# Altium schematic sheet Схемотехника-2.SchDoc
size 500 x 500 mm
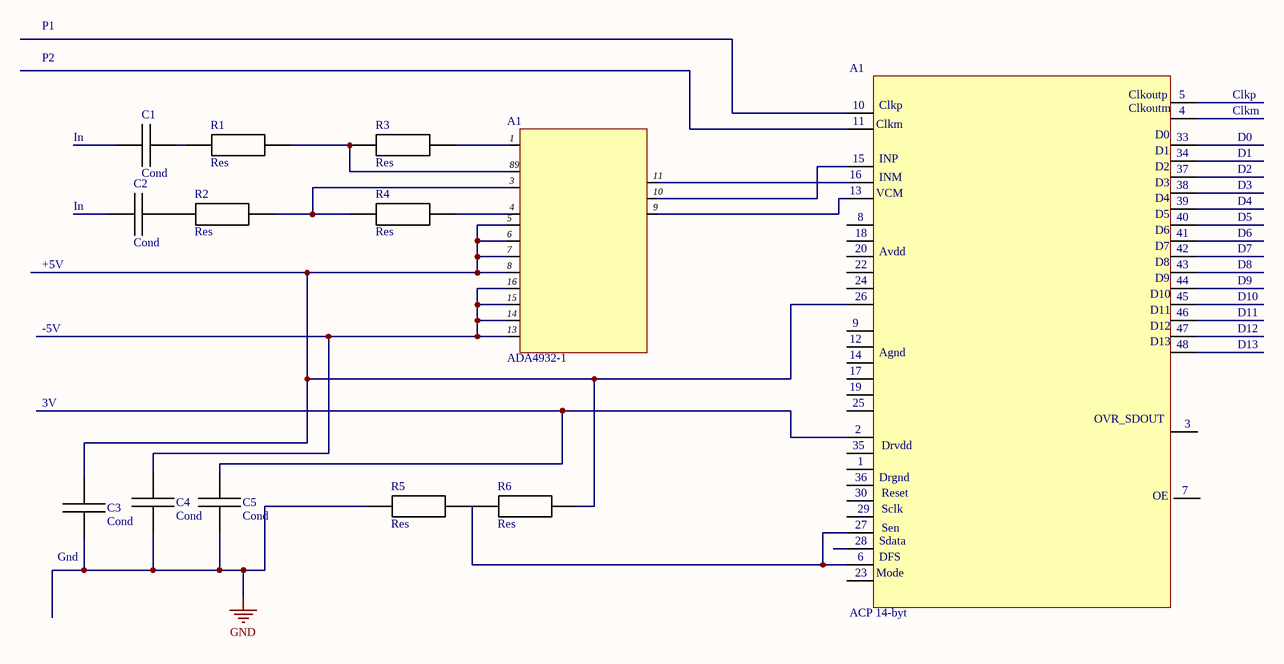
[diagram p0: Схемотехника-2.SchDoc]

## Parts
(Parts that share a designator on the sheet are numbered #1, #2 ... from top to bottom, then left to right.)
A1#1  ADA4932-1  [ADA4932-2]
A1#2  ACP 14-byt  [ads61b49]
C1  Cond  [Capacitor]
C2  Cond  [Capacitor]
C3  Cond  [Capacitor]
C4  Cond  [Capacitor]
C5  Cond  [Capacitor]
R1  Res  [Resistor]
R2  Res  [Resistor]
R3  Res  [Resistor]
R4  Res  [Resistor]
R5  Res  [Resistor]
R6  Res  [Resistor]

## Nets
GND: C3.2 C4.2 C5.2 R5.1
NetA1#1_1: A1#1.1 R3.2
NetA1#1_3: A1#1.3 R2.2 R4.1
NetA1#1_4: A1#1.4 R4.2
NetA1#1_5: A1#1.5 A1#1.6 A1#1.7 A1#1.8 A1#2.26 C3.1 R6.2
NetA1#1_9: A1#1.9 A1#2.13
NetA1#1_10: A1#1.10 A1#2.15
NetA1#1_11: A1#1.11 A1#2.16
NetA1#1_13: A1#1.13 A1#1.14 A1#1.15 A1#1.16 C4.1
NetA1#1_89: A1#1.89 R1.2 R3.1
NetA1#2_2: A1#2.2 C5.1
NetA1#2_6: A1#2.6 A1#2.27 R5.2 R6.1
NetC1_1: C1.1 R1.1
NetC2_1: C2.1 R2.1

Not connected (* = marked no-connect by the designer): A1#2 1 3 4 5 7 8 9 10 11 12 14 17 18 19 20 22 23 24 25 28 29 30 33 34 35 36 37 38 39 40 41 42 43 44 45 46 47; C1 2; C2 2

## Notes on the sheet
- P1
- P2
- Clkp
- Clkm
- In
- D0
- D1
- D2
- (near C2) In
- D3
- D4
- D5
- D6
- D7
- +5V
- D8
- D9
- D10
- D11
- -5V
- D12
- D13
- 3V
- (near C3) Gnd
- (in symbol ACP 14-byt) Clkoutp; Clkp; Clkoutm; Clkm; D0; D1; INP; D2; INM; D3; VCM; D4; D5; D6; D7; Avdd; D8; D9; D10; D11; D12; D13; Agnd; OVR_SDOUT; Drvdd; Drgnd; Reset; OE; Sclk; Sen; Sdata; DFS; Mode